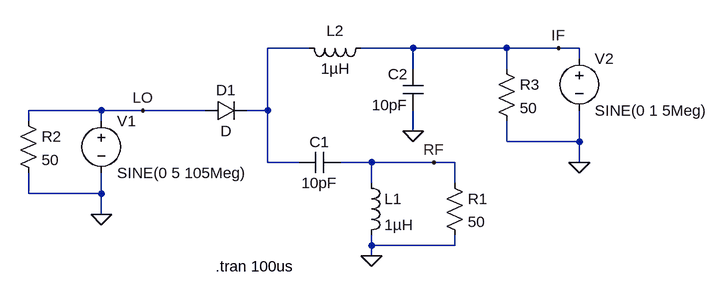
[diagram p0: schematic single_diode_mixer.asc]
single_diode_mixer.asc, the LTspice schematic file:
Version 4
SHEET 1 1092 680
WIRE 256 64 192 64
WIRE 416 64 336 64
WIRE 560 64 416 64
WIRE 640 64 560 64
WIRE 672 64 640 64
WIRE 672 80 672 64
WIRE 416 96 416 64
WIRE 560 96 560 64
WIRE -64 160 -176 160
WIRE 0 160 -64 160
WIRE 96 160 0 160
WIRE 192 160 192 64
WIRE 192 160 160 160
WIRE -176 176 -176 160
WIRE -64 176 -64 160
WIRE 416 192 416 160
WIRE 560 208 560 176
WIRE 672 208 672 160
WIRE 672 208 560 208
WIRE 192 240 192 160
WIRE 240 240 192 240
WIRE 352 240 304 240
WIRE 448 240 352 240
WIRE 480 240 448 240
WIRE 672 240 672 208
WIRE 352 272 352 240
WIRE 480 272 480 240
WIRE -176 288 -176 256
WIRE -64 288 -64 256
WIRE -64 288 -176 288
WIRE -64 320 -64 288
WIRE 352 368 352 352
WIRE 480 368 480 352
WIRE 480 368 352 368
WIRE 352 384 352 368
FLAG 352 384 0
FLAG 416 192 0
FLAG -64 320 0
FLAG 672 240 0
FLAG 0 160 LO
FLAG 640 64 IF
FLAG 448 240 RF
SYMBOL diode 96 176 R270
WINDOW 0 32 32 VTop 2
WINDOW 3 0 32 VBottom 2
SYMATTR InstName D1
SYMBOL cap 304 224 R90
WINDOW 0 0 32 VBottom 2
WINDOW 3 32 32 VTop 2
SYMATTR InstName C1
SYMATTR Value 10pF
SYMBOL cap 432 160 R180
WINDOW 0 24 56 Left 2
WINDOW 3 24 8 Left 2
SYMATTR InstName C2
SYMATTR Value 10pF
SYMBOL ind 336 256 R0
SYMATTR InstName L1
SYMATTR Value 1µH
SYMBOL ind 352 48 R90
WINDOW 0 5 56 VBottom 2
WINDOW 3 32 56 VTop 2
SYMATTR InstName L2
SYMATTR Value 1µH
SYMBOL res 464 256 R0
SYMATTR InstName R1
SYMATTR Value 50
SYMBOL voltage -64 160 R0
WINDOW 123 0 0 Left 0
WINDOW 39 0 0 Left 0
SYMATTR InstName V1
SYMATTR Value SINE(0 5 105Meg)
SYMBOL voltage 672 64 R0
WINDOW 123 0 0 Left 0
WINDOW 39 0 0 Left 0
SYMATTR InstName V2
SYMATTR Value SINE(0 1 5Meg)
SYMBOL res -192 160 R0
SYMATTR InstName R2
SYMATTR Value 50
SYMBOL res 544 80 R0
SYMATTR InstName R3
SYMATTR Value 50
TEXT 112 400 Left 2 !.tran 100us

The netlist it stands for:
* single_diode_mixer.asc
D1 LO N001 D
C1 RF N001 10pF
C2 0 IF 10pF
L1 RF 0 1µH
L2 IF N001 1µH
R1 RF 0 50
V1 LO 0 SINE(0 5 105Meg)
V2 IF 0 SINE(0 1 5Meg)
R2 LO 0 50
R3 IF 0 50
.model D D
.lib standard.dio
.tran 100us
.backanno
.end